# Altium schematic sheet Sheet4.schdoc
size B; SheetNumber: 0; SheetTotal: 0
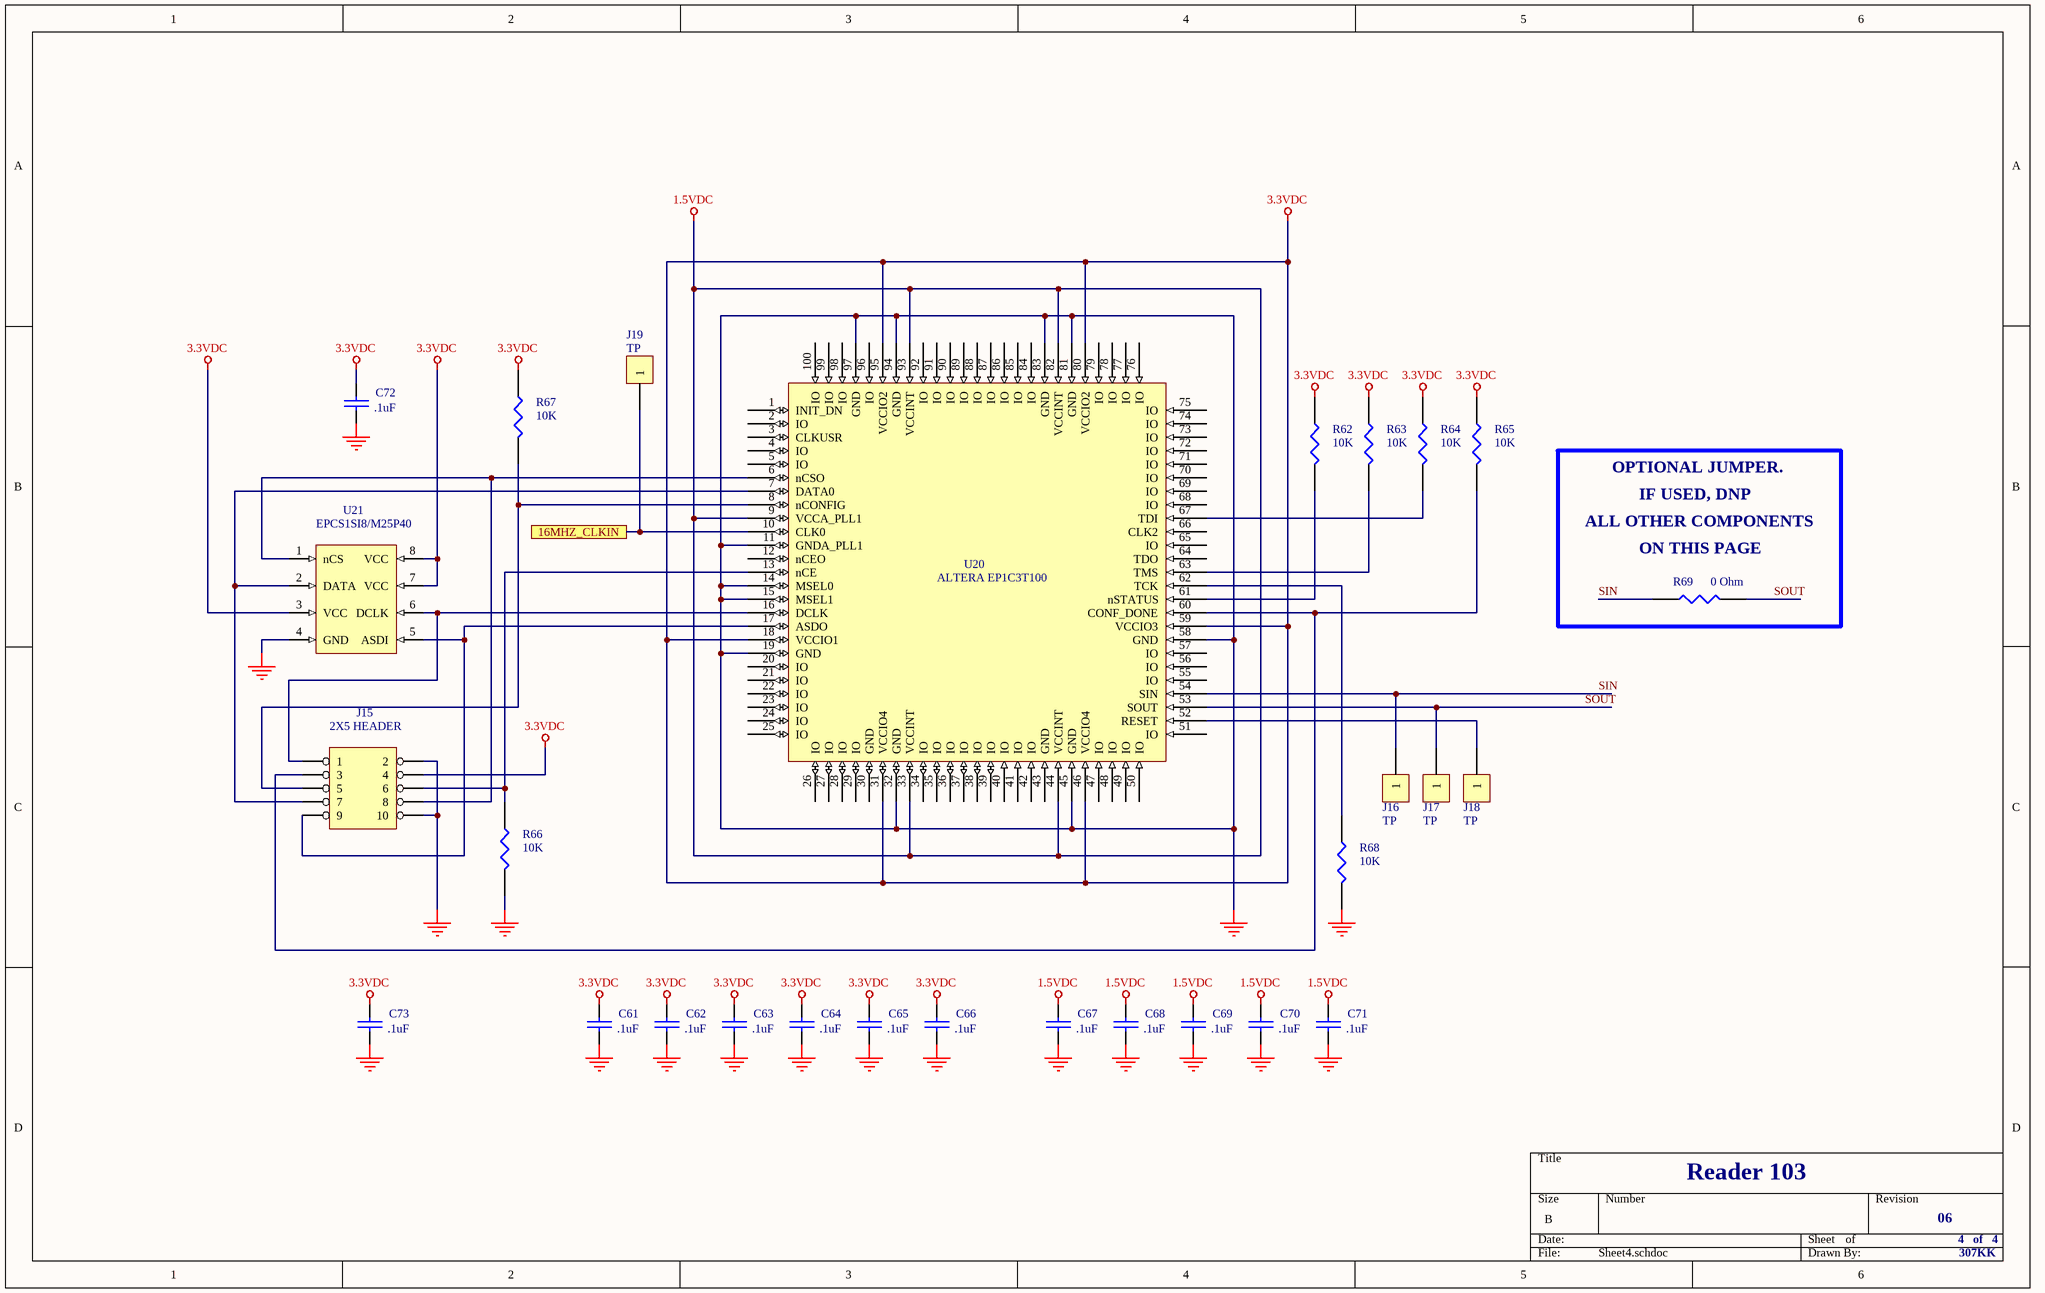
[diagram p0: Sheet4.schdoc]

## Parts
C61  .1uF  [0603]
C62  .1uF  [0603]
C63  .1uF  [0603]
C64  .1uF  [0603]
C65  .1uF  [0603]
C66  .1uF  [0603]
C67  .1uF  [0603]
C68  .1uF  [0603]
C69  .1uF  [0603]
C70  .1uF  [0603]
C71  .1uF  [0603]
C72  .1uF  [0603]
C73  .1uF  [0603]
J15  2X5 HEADER  [2X5 HEADER]
J16  TP  [TEST POINT PAD 3]
J17  TP  [TEST POINT PAD 3]
J18  TP  [TEST POINT PAD 3]
J19  TP  [TEST POINT PAD 3]
R62  10K  [0603]
R63  10K  [0603]
R64  10K  [0603]
R65  10K  [0603]
R66  10K  [0603]
R67  10K  [0603]
R68  10K  [0603]
R69  0 Ohm  [0603]
U20  ALTERA EP1C3T100  [TQFP100]
U21  EPCS1SI8/M25P40  [SO8]

## Ports
16MHZ_CLKIN

## Nets
1.5VDC: C67.1 C68.1 C69.1 C70.1 C71.1 U20.9(VCCA_PLL1) U20.33(VCCINT) U20.44(VCCINT) U20.82(VCCINT) U20.93(VCCINT)
3.3VDC: C61.1 C62.1 C63.1 C64.1 C65.1 C66.1 C72.1 C73.1 J15.4 R62.1 R63.1 R64.1 R65.1 R67.1 U20.18(VCCIO1) U20.31(VCCIO4) U20.46(VCCIO4) U20.59(VCCIO3) U20.80(VCCIO2) U20.95(VCCIO2) U21.3(VCC) U21.7(VCC) U21.8(VCC)
GND_COM: C61.2 C62.2 C63.2 C64.2 C65.2 C66.2 C67.2 C68.2 C69.2 C70.2 C71.2 C72.2 C73.2 J15.2 J15.10 R66.2 R68.2 U20.11(GNDA_PLL1) U20.14(MSEL0) U20.15(MSEL1) U20.19(GND) U20.32(GND) U20.45(GND) U20.58(GND) U20.81(GND) U20.83(GND) U20.94(GND) U20.97(GND) U21.4(GND)
16MHZ_CLKIN: J19.1 U20.10(CLK0) ; port 16MHZ_CLKIN
SIN: J16.1 R69.1 U20.54(SIN)
SOUT: J17.1 R69.2 U20.53(SOUT)
NetJ15_1: J15.1 U20.16(DCLK) U21.6(DCLK)
NetJ15_3: J15.3 R65.2 U20.60(CONF_DONE)
NetJ15_5: J15.5 R67.2 U20.8(nCONFIG)
NetJ15_6: J15.6 R66.1 U20.13(nCE)
NetJ15_7: J15.7 U20.7(DATA0) U21.2(DATA)
NetJ15_8: J15.8 U20.6(nCSO) U21.1(nCS)
NetJ15_9: J15.9 U20.17(ASDO) U21.5(ASDI)
NetJ18_1: J18.1 U20.52(RESET)
NetR62_2: R62.2 U20.61(nSTATUS)
NetR63_2: R63.2 U20.63(TMS)
NetR64_2: R64.2 U20.67(TDI)
NetR68_1: R68.1 U20.62(TCK)

Not connected (* = marked no-connect by the designer): U20 1(INIT_DN) 2(IO) 3(CLKUSR) 4(IO) 5(IO) 12(nCEO) 20(IO) 21(IO) 22(IO) 23(IO) 24(IO) 25(IO) 26(IO) 27(IO) 28(IO) 29(IO) 30(GND) 34(IO) 35(IO) 36(IO) 37(IO) 38(IO) 39(IO) 40(IO) 41(IO) 42(IO) 43(GND) 47(IO) 48(IO) 49(IO) 50(IO) 51(IO) 55(IO) 56(IO) 57(IO) 64(TDO) 65(IO) 66(CLK2) 68(IO) 69(IO) 70(IO) 71(IO) 72(IO) 73(IO) 74(IO) 75(IO) 76(IO) 77(IO) 78(IO) 79(IO) 84(IO) 85(IO) 86(IO) 87(IO) 88(IO) 89(IO) 90(IO) 91(IO) 92(IO) 96(IO) 98(IO) 99(IO) 100(IO)

## Notes on the sheet
- OPTIONAL JUMPER.
- IF USED, DNP
- ALL OTHER COMPONENTS
- (near R69) ON THIS PAGE
- Reader 103
- 06
- 4   of   4
- 307KK

## Library data of the parts
C61-C73 = CAP: Capacitor
J15 = HEADER 5X2
J16-J19 = CON1: Connector
R62-R69 = RES1